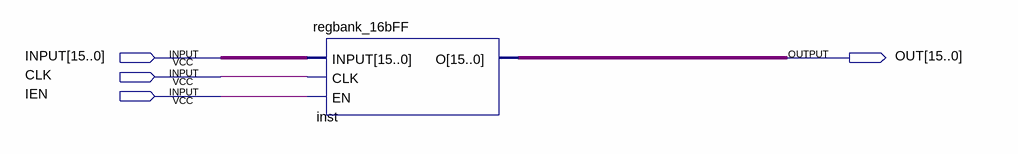
[diagram p0: schematic sheet]
// Quartus schematic regbank_16bRegister.bdf as structural Verilog: 1 symbols, 4 pins
module regbank_16bRegister (
  input  [15:0] INPUT,
  input  CLK,
  input  IEN,
  output [15:0] OUT
);

  regbank_16bFF inst (.INPUT(INPUT), .CLK(CLK), .EN(IEN), .O(OUT));
endmodule
